# Altium schematic sheet Sheet1.SchDoc
size A4; SheetNumber: 1; SheetTotal: 1
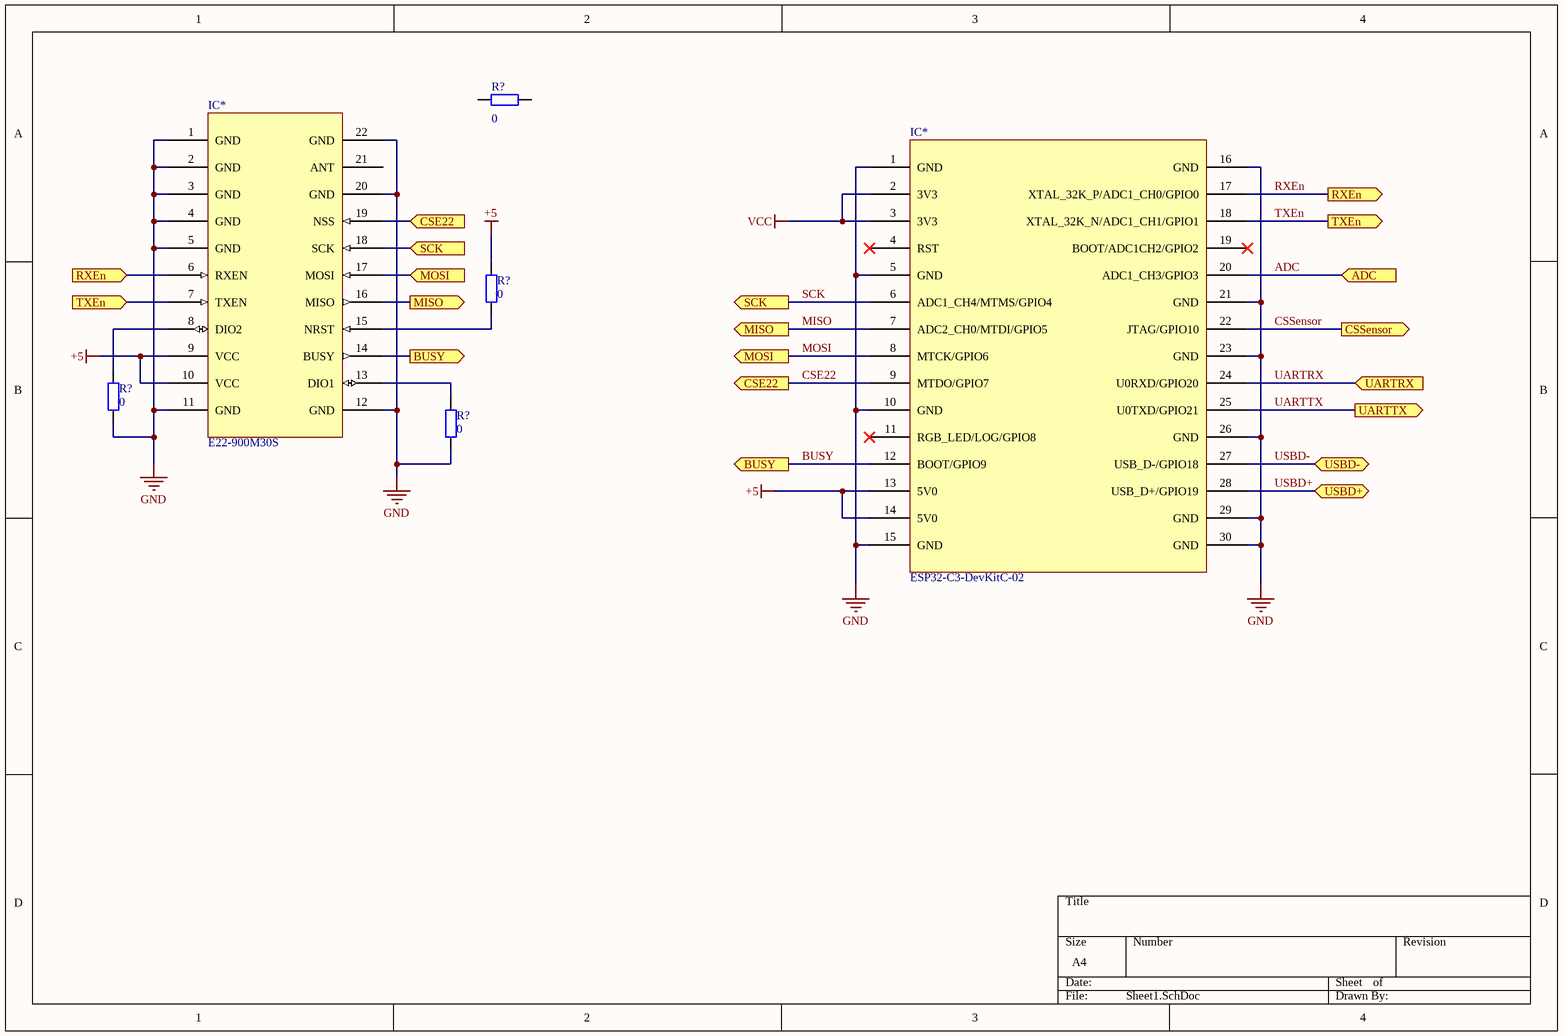
[diagram p0: Sheet1.SchDoc]

## Parts
(Parts that share a designator on the sheet are numbered #1, #2 ... from top to bottom, then left to right.)
IC*#1  E22-900M30S  [E22-900M30S]
IC*#2  ESP32-C3-DevKitC-02  [ESP32-C3-DevKitC-02]
R?#1  value 0  [RES 1206]  (hidden comment: Res2)
R?#2  value 0  [RES 1206]  (hidden comment: Res2)
R?#3  value 0  [RES 1206]  (hidden comment: Res2)
R?#4  value 0  [RES 1206]  (hidden comment: Res2)

## Ports
ADC (in), BUSY (out), CSE22 (in), CSE22 (out), CSSensor (out), MISO (out), MOSI (in), MOSI (out), RXEn (in), RXEn (out), SCK (in), SCK (out), TXEn (in), TXEn (out), UARTRX (in), UARTTX (out), USBD+ (bidir), USBD- (bidir)

## Nets
+5: IC*#1.9(VCC) IC*#1.10(VCC) IC*#2.13(5V0) IC*#2.14(5V0) R?#2.2
GND: IC*#1.1(GND) IC*#1.2(GND) IC*#1.3(GND) IC*#1.4(GND) IC*#1.5(GND) IC*#1.11(GND) IC*#1.12(GND) IC*#1.20(GND) IC*#1.22(GND) IC*#2.1(GND) IC*#2.5(GND) IC*#2.10(GND) IC*#2.15(GND) IC*#2.16(GND) IC*#2.21(GND) IC*#2.23(GND) IC*#2.26(GND) IC*#2.29(GND) IC*#2.30(GND) R?#3.1 R?#4.1
VCC: IC*#2.2(3V3) IC*#2.3(3V3)
ADC: IC*#2.20(ADC1_CH3/GPIO3) ; port ADC
BUSY: IC*#1.14(BUSY) IC*#2.12(BOOT/GPIO9) ; port BUSY
CSE22: IC*#1.19(NSS) IC*#2.9(MTDO/GPIO7) ; port CSE22
CSSensor: IC*#2.22(JTAG/GPIO10) ; port CSSensor
MISO: IC*#1.16(MISO) IC*#2.7(ADC2_CH0/MTDI/GPIO5) ; port MISO
MOSI: IC*#1.17(MOSI) IC*#2.8(MTCK/GPIO6) ; port MOSI
RXEn: IC*#1.6(RXEN) IC*#2.17(XTAL_32K_P/ADC1_CH0/GPIO0) ; port RXEn
SCK: IC*#1.18(SCK) IC*#2.6(ADC1_CH4/MTMS/GPIO4) ; port SCK
TXEn: IC*#1.7(TXEN) IC*#2.18(XTAL_32K_N/ADC1_CH1/GPIO1) ; port TXEn
UARTRX: IC*#2.24(U0RXD/GPIO20) ; port UARTRX
UARTTX: IC*#2.25(U0TXD/GPIO21) ; port UARTTX
USBD+: IC*#2.28(USB_D+/GPIO19) ; port USBD+
USBD-: IC*#2.27(USB_D-/GPIO18) ; port USBD-
NetIC*#1_8: IC*#1.8(DIO2) R?#3.2
NetIC*#1_13: IC*#1.13(DIO1) R?#4.2
NetIC*#1_15: IC*#1.15(NRST) R?#2.1

Not connected (* = marked no-connect by the designer): IC*#1 21(ANT); IC*#2 4(RST)* 11(RGB_LED/LOG/GPIO8)* 19(BOOT/ADC1CH2/GPIO2)*; R?#1 1 2

## Library data of the parts
IC*#1 = E22-900M30S: The E22-900M30S is based on the SX1262, a new generation of / LoRaTM RF chip manufactured by Semtech, USA. It is an ultra-small / and self-developed 868MHz、915MHz SMD LoRaTM wireless module.; Datasheet: https://www.ebyte.com/en/downpdf.aspx?id=453
IC*#2 = ESP32-C3-DevKitC-02: ESP32-C3-DevKitC-02 is an entry-level development board based on ESP32-C3-WROOM-02, a general-purpose module with 4 MB SPI flash. This board integrates complete Wi-Fi and Bluetooth LE functions.
R?#1-R?#4 = Res2: Resistor; Published: 8-Jun-2000; LatestRevisionDate: 17-Jul-2002; LatestRevisionNote: Re-released for DXP Platform.; PackageReference: AXIAL-0.4; Publisher: Altium Limited; PackageDescription: Axial Device, Thru-Hole; 2 Leads; 0.4 in Pin Spacing